# EAGLE design S2ER11 (EAGLE 7.2.0)
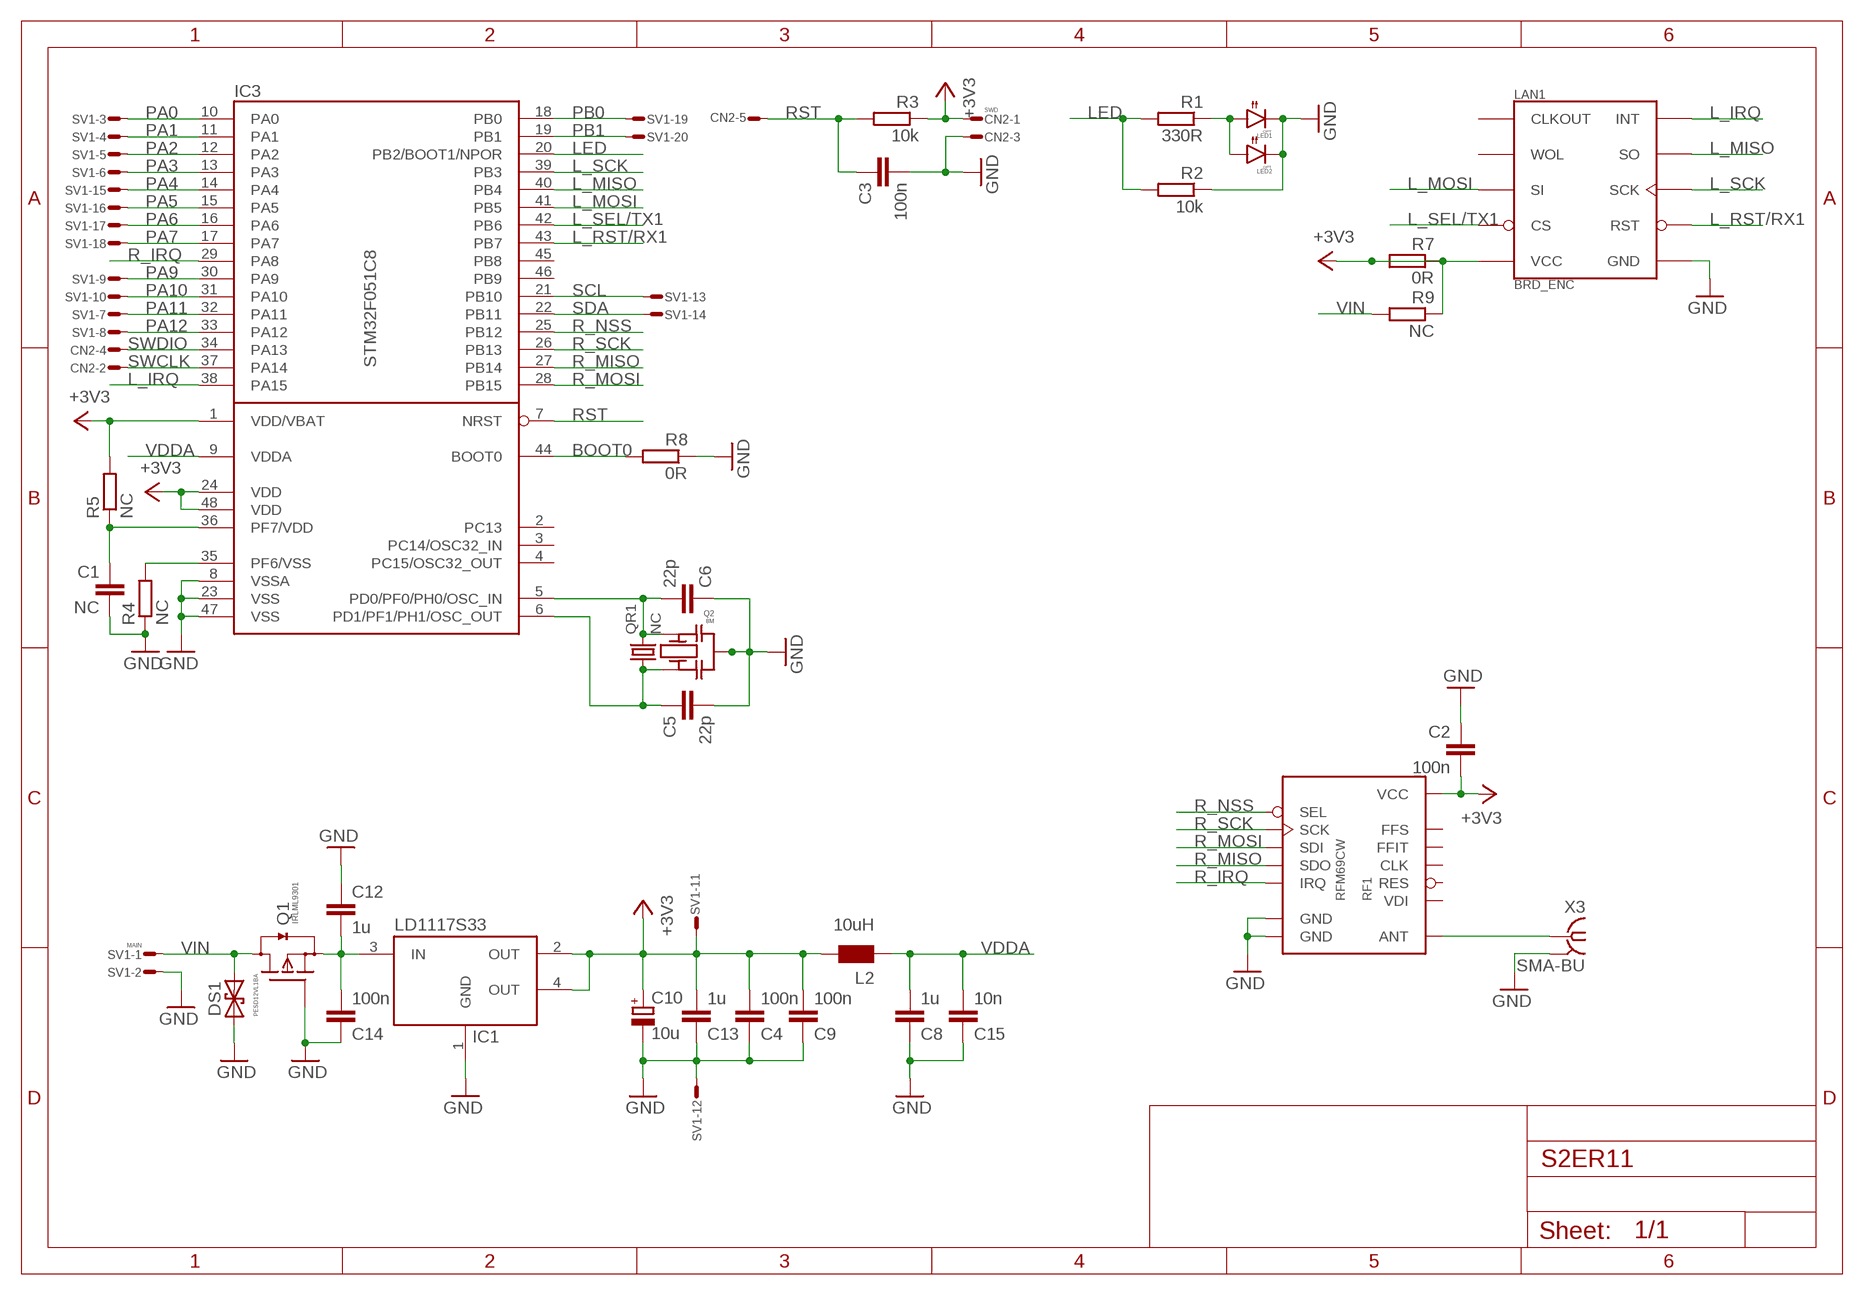
[diagram p0: schematic, sheet 1]

## Parts
C1  NC  C0603  [0603]
C2  100n  C0603  [0603]
C3  100n  C0603  [0603]
C4  100n  C0603  [0603]
C5  22p  C0603  [0603]
C6  22p  C0603  [0603]
C8  1u  C0603  [0603]
C9  100n  C0603  [0603]
C10  10u  C_POLSMCA  [SMC_A]
C12  1u  C0603  [0603]
C13  1u  C0603  [0603]
C14  100n  C0603  [0603]
C15  10n  C0603  [0603]
CN2  SWD  CON6L  [CON6L]
DS1  PESD12VL1BA  TVS-U323  [SOD323]
IC1  LD1117S33  LDO_4P  [SOT223]
IC3  STM32F051C8  STM32_LQFP48  [LQFP48]
L2  10uH  L0603  [0603]
LAN1  BRD_ENC  [BRD_ENC]
LED1  OPT  LEDT134  [T1-3/4]
LED2  OPT  LED1206  [1206]
Q1  IRLML9301  FET-PDSOT23  [SOT23]
Q2  8M  QRCE  [CSTCE]
QR1  NC  QABS07  [ABS07]
R1  330R  R0603  [0603]
R2  10k  R0603  [0603]
R3  10k  R0603  [0603]
R4  NC  R0402  [0402]
R5  NC  R0402  [0402]
R7  0R  R0603  [0603]
R8  0R  R0402  [0402]
R9  NC  R0603  [0603]
RF1  RFM69CW  RFM12B-868-S1  [RFM12B]
SV1  MAIN  ML20LSE  [ML20LS]
X3  SMA-BU  [BU-SMA-V]

## Nets
+3V3: C2.2 C4.2 C9.2 C10.+ C13.2 CN2.1 IC1.2(OUT) IC1.4(OUT) IC3.1(VDD/VBAT) IC3.24(VDD) IC3.48(VDD) L2.2 LAN1.P$9(VCC) R3.1 R5.2 R7.1 R7.2 R9.1 RF1.VDD(VCC) SV1.P$11
BOOT0: IC3.44(BOOT0) R8.2
GND: C1.2 C2.1 C3.2 C4.1 C5.2 C6.1 C8.1 C9.1 C10.- C12.1 C13.1 C14.1 C15.1 CN2.3 DS1.A IC1.1(GND) IC3.8(VSSA) IC3.23(VSS) IC3.47(VSS) LAN1.P$10(GND) LED1.C LED2.2(C) Q1.1(G) Q2.G(M) R2.1 R4.1 R8.1 RF1.GND RF1.GND@1(GND) SV1.P$2 SV1.P$12 X3.2 X3.3 X3.4 X3.5
L_IRQ: IC3.38(PA15) LAN1.P$2(INT)
L_MISO: IC3.40(PB4) LAN1.P$4(SO)
L_MOSI: IC3.41(PB5) LAN1.P$5(SI)
L_RST/RX1: IC3.43(PB7) LAN1.P$8(RST)
L_SCK: IC3.39(PB3) LAN1.P$6(SCK)
L_SEL/TX1: IC3.42(PB6) LAN1.P$7(CS)
LED: IC3.20(PB2/BOOT1/NPOR) R1.2 R2.2
N$1: LED1.A LED2.1(A) R1.1
N$2: IC3.35(PF6/VSS) R4.2
N$3: C1.1 IC3.36(PF7/VDD) R5.1
N$5: RF1.ANT X3.1
N$20: C6.2 IC3.5(PD0/PF0/PH0/OSC_IN) Q2.A QR1.P$2
N$21: C5.1 IC3.6(PD1/PF1/PH1/OSC_OUT) Q2.B QR1.P$1
N$31: C12.2 C14.2 IC1.3(IN) Q1.2(S)
PA0: IC3.10(PA0) SV1.P$3
PA1: IC3.11(PA1) SV1.P$4
PA2: IC3.12(PA2) SV1.P$5
PA3: IC3.13(PA3) SV1.P$6
PA4: IC3.14(PA4) SV1.P$15
PA5: IC3.15(PA5) SV1.P$16
PA6: IC3.16(PA6) SV1.P$17
PA7: IC3.17(PA7) SV1.P$18
PA9: IC3.30(PA9) SV1.P$9
PA10: IC3.31(PA10) SV1.P$10
PA11: IC3.32(PA11) SV1.P$7
PA12: IC3.33(PA12) SV1.P$8
PB0: IC3.18(PB0) SV1.P$19
PB1: IC3.19(PB1) SV1.P$20
R_IRQ: IC3.29(PA8) RF1.IRQ
R_MISO: IC3.27(PB14) RF1.SDO
R_MOSI: IC3.28(PB15) RF1.SDI
R_NSS: IC3.25(PB12) RF1.SEL
R_SCK: IC3.26(PB13) RF1.SCK
RST: C3.1 CN2.5 IC3.7(NRST) R3.2
SCL: IC3.21(PB10) SV1.P$13
SDA: IC3.22(PB11) SV1.P$14
SWCLK: CN2.2 IC3.37(PA14)
SWDIO: CN2.4 IC3.34(PA13)
VDDA: C8.2 C15.2 IC3.9(VDDA) L2.1
VIN: DS1.C Q1.3(D) R9.2 SV1.P$1
Unconnected: CN2.6 IC3.2(PC13) IC3.3(PC14/OSC32_IN) IC3.4(PC15/OSC32_OUT) IC3.45(PB8) IC3.46(PB9) LAN1.P$1(CLKOUT) LAN1.P$3(WOL) RF1./RES(RES) RF1.CFIL(FFIT) RF1.CLK RF1.FFS RF1.INT(VDI)

## Library data of the parts
C1-C6 C8 C9 C12-C15 = RCL:C: Capacitor SMD
C10 = RCL:C_POL: POLARIZED CAPACITOR, European symbol
CN2 = Conn:CON6
DS1 = Diode:TVS-U: DIODE
IC1 = DCDC:LDO_4P
IC3 = STM32:STM32_LQFP48
L2 = RCL:L
LAN1 = brd_enc:BRD_ENC
LED1 LED2 = Optic:LED
Q1 = Transistor:FET-PD
Q2 = QUARTZ:QR
QR1 = QUARTZ:Q
R1-R5 R7-R9 = RCL:R: Resistor SMD
RF1 = RF:RFM12B: 5dB Transceiver Module
SV1 = Conn:ML20?E: HARTING
X3 = Conn:SMA-: SMA 50 Ohm End Launch Jack Receptacle - Round Contact Johnson Components Source: www.johnsoncomponents.com .. J502-ND.pdf

## Board
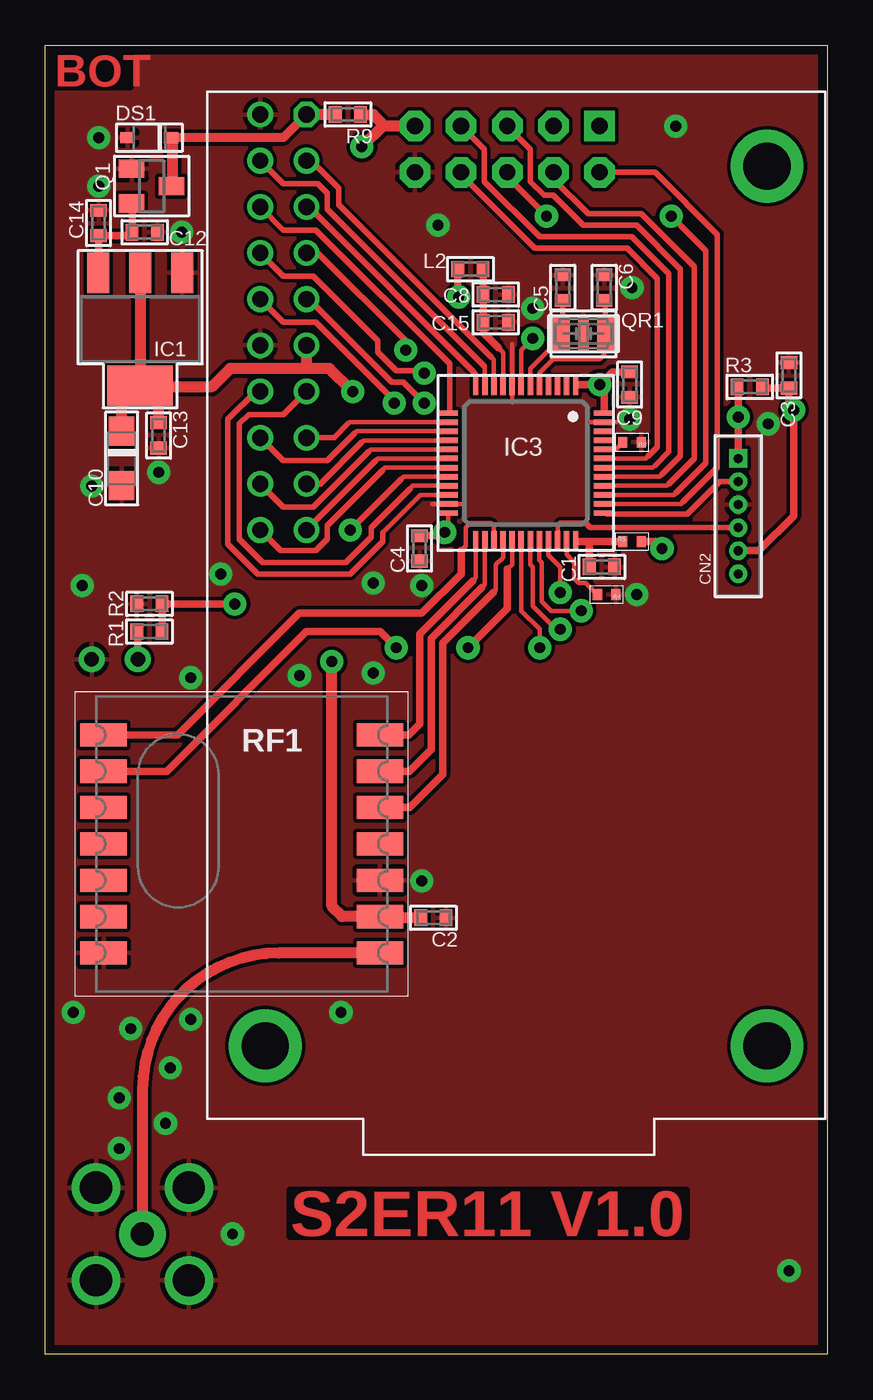
[diagram p1: board, top side]
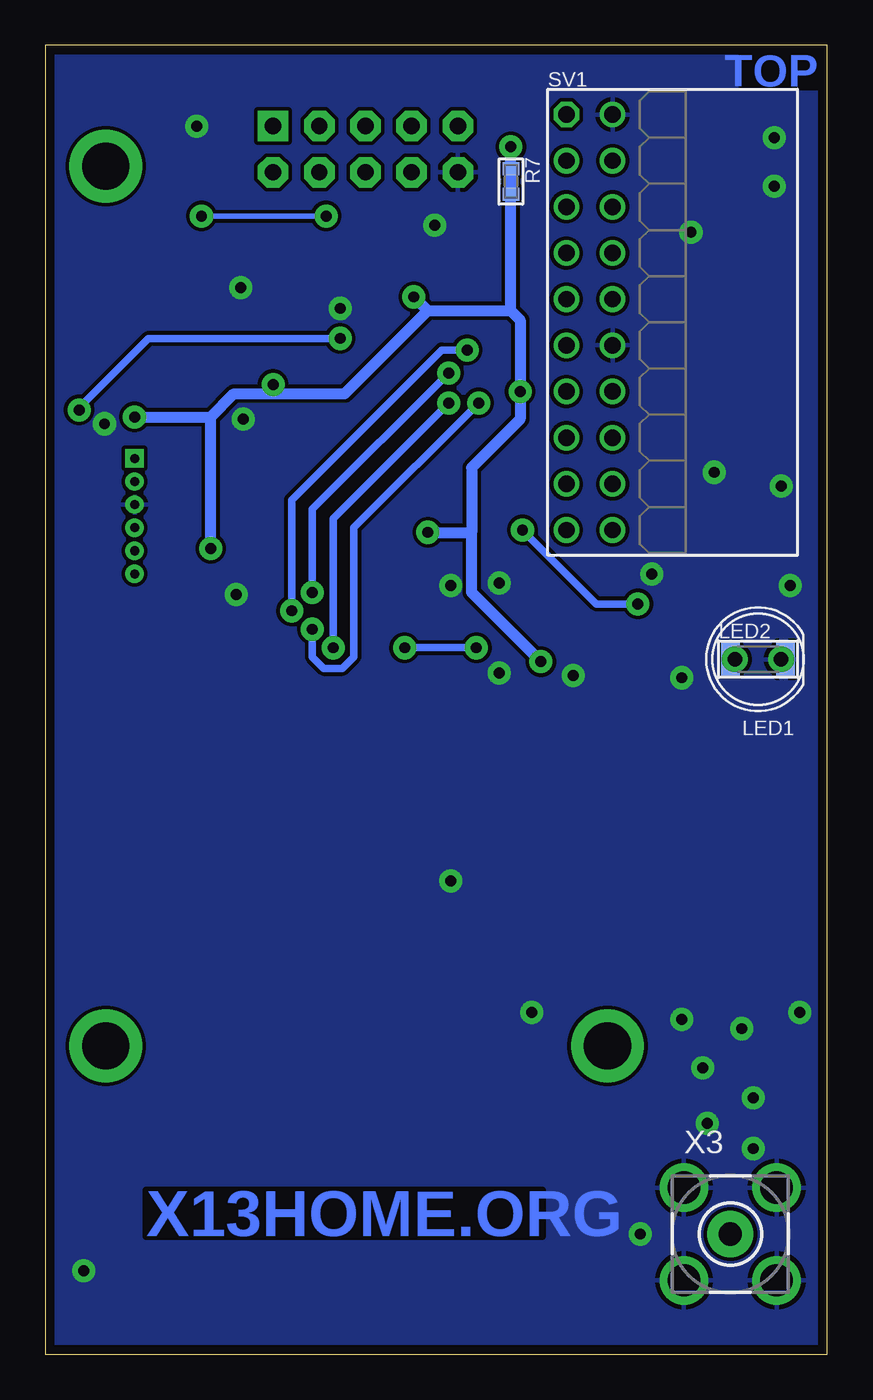
[diagram p2: board, bottom side, seen from below]

Size 43 x 72 mm. Coordinates in mm from the lower left corner, seen from the top.
Outline: 43,0 0,0 0,72 43,72 43,0
Copper layers (1*16): Top 0.035mm / dielectric 1.5mm / Bottom 0.035mm
Design rules "default *": minimum track width 8mil, minimum drill 10mil, track to track 8mil, track to pad 8mil, pad to pad 6mil, via to via 8mil, smd to smd 6mil, copper to edge 20mil, drill to drill 8mil, minimum pad ring 10mil, minimum via ring 8mil, stop-mask expansion 2mil, vias tented up to drill 25mil, thermal gap 10mil
tKeepout: area 0,0 to 43,2.5; area 0,69.5 to 43,72
bKeepout: area 0,0 to 43,1.3; area 0,70.7 to 43,72

### Footprints (pad centres in the part's own frame; a part is rotated, then mirrored left to right if it is on the bottom)
0603 = smd 0.7 x 0.9: 1 -0.697,0; 2 0.697,0
SMC_A = smd 1.6 x 1.4: + -1.5,0; - 1.5,0
CON6L = drill 0.5 pad 0.813 square: 1 0,3.81 | drill 0.5 pad 0.813: 2 0,2.54; 3 0,1.27; 4 0,0; 5 0,-1.27; 6 0,-2.54
SOD323 = smd 0.8 x 0.6: A 1.2,0; C -1.2,0
SOT223 = smd 1.219 x 2.235: 1 -2.311,-3.099; 2 0,-3.099; 3 2.311,-3.099 | smd 3.6 x 2.2: 4 0,3.099
LQFP48 = smd 0.3 x 1: 1 -2.75,-4.25; 2 -2.25,-4.25; 3 -1.75,-4.25; 4 -1.25,-4.25; 5 -0.75,-4.25; 6 -0.25,-4.25; 7 0.25,-4.25; 8 0.75,-4.25; 9 1.25,-4.25; 10 1.75,-4.25; 11 2.25,-4.25; 12 2.75,-4.25; 25 2.75,4.25; 26 2.25,4.25; 27 1.75,4.25; 28 1.25,4.25; 29 0.75,4.25; 30 0.25,4.25; 31 -0.25,4.25; 32 -0.75,4.25; 33 -1.25,4.25; 34 -1.75,4.25; 35 -2.25,4.25; 36 -2.75,4.25 | smd 1 x 0.3: 13 4.25,-2.75; 14 4.25,-2.25; 15 4.25,-1.75; 16 4.25,-1.25; 17 4.25,-0.75; 18 4.25,-0.25; 19 4.25,0.25; 20 4.25,0.75; 21 4.25,1.25; 22 4.25,1.75; 23 4.25,2.25; 24 4.25,2.75; 37 -4.25,2.75; 38 -4.25,2.25; 39 -4.25,1.75; 40 -4.25,1.25; 41 -4.25,0.75; 42 -4.25,0.25; 43 -4.25,-0.25; 44 -4.25,-0.75; 45 -4.25,-1.25; 46 -4.25,-1.75; 47 -4.25,-2.25; 48 -4.25,-2.75
BRD_ENC = drill 0.9 pad 1.676 square: P$1 21.59,54.61 | drill 0.9 pad 1.676 octagon: P$2 21.59,52.07; P$3 19.05,54.61; P$4 19.05,52.07; P$5 16.51,54.61; P$6 16.51,52.07; P$7 13.97,54.61; P$8 13.97,52.07; P$9 11.43,54.61; P$10 11.43,52.07 | drill 2.6 pad 4: PAD@1 3.2,4; PAD@2 30.8,4; PAD@3 30.8,52.4
T1-3/4 = drill 0.8 pad 1.422: A 1.27,0; C -1.27,0
1206 = smd 1.016 x 1.778: 1 -1.524,0; 2 1.524,0
SOT23 = smd 1 x 1.4: 1 -0.95,-1.1; 2 0.95,-1.1; 3 0,1.1
CSTCE = smd 0.6 x 2: A -1.2,0; B 1.2,0; G 0,0
ABS07 = smd 1 x 1.8: P$1 -1.25,0; P$2 1.25,0
0402 = smd 0.5 x 0.6: 1 -0.5,0; 2 0.5,0
RFM12B = smd 2.54 x 1.27: /RES -7.6,-4; ANT 7.6,-6; CFIL -7.6,0; CLK -7.6,-2; FFS -7.6,2; GND 7.6,-2; GND@1 -7.6,-6; INT 7.6,0; IRQ -7.6,4; SCK 7.6,4; SDI 7.6,2; SDO -7.6,6; SEL 7.6,6; VDD 7.6,-4
ML20LS = drill 0.9 octagon: P$1 -11.43,-1.27 | drill 0.9: P$2 -11.43,1.27; P$3 -8.89,-1.27; P$4 -8.89,1.27; P$5 -6.35,-1.27; P$6 -6.35,1.27; P$7 -3.81,-1.27; P$8 -3.81,1.27; P$9 -1.27,-1.27; P$10 -1.27,1.27; P$11 1.27,-1.27; P$12 1.27,1.27; P$13 3.81,-1.27; P$14 3.81,1.27; P$15 6.35,-1.27; P$16 6.35,1.27; P$17 8.89,-1.27; P$18 8.89,1.27; P$19 11.43,-1.27; P$20 11.43,1.27
BU-SMA-V = drill 1.27 pad 2.54: 1 0,0 | drill 1.778: 2 -2.55,2.55; 3 2.55,2.55; 4 2.55,-2.55; 5 -2.55,-2.55

### Placement (x,y rotation side)
C1  30.61,43.31 0 top
C2  21.34,24 180 top
C3  40.89,53.85 90 top
C4  20.57,44.32 90 top
C5  28.45,58.67 90 top
C6  30.73,58.67 270 top
C8  24.77,58.29 180 top
C9  32.13,53.34 90 top
C10  4.19,49.28 270 top
C12  5.46,61.72 180 top
C13  6.22,50.55 90 top
C14  2.92,62.23 270 top
C15  24.77,56.77 180 top
CN2  38.1,45.47 0 top
DS1  5.71,66.93 180 top
IC1  5.21,56.39 180 top
IC3  26.42,49.02 180 top
L2  23.37,59.69 180 top
LAN1  8.89,12.95 0 top
LED1  3.81,38.23 180 bottom
LED2  3.81,38.23 0 bottom
Q1  5.84,64.26 270 top
Q2  29.59,56.13 180 top
QR1  29.59,56.13 0 top
R1  5.71,39.75 0 top
R2  5.71,41.27 0 top
R3  38.73,53.21 0 top
R4  30.86,41.78 180 top
R5  32.26,44.7 0 top
R7  17.4,64.52 270 bottom
R8  32.26,50.16 180 top
R9  16.64,68.2 180 top
RF1  10.79,28.07 0 top
SV1  13.08,56.77 270 bottom
X3  5.33,6.6 0 bottom

### Tracks (layer width: path | path; a pad name or v marks a point on that pad's centre or on a via)
+3V3  (via drill 0.6 pad 1.27)
  Top 0.203: IC3.48 30.67,51.88 30.73,51.94
  Top 0.254: IC3.1 29.27,53.27 29.34,53.34 | IC3.24 22.17,45.41 v21.97,45.21
  Top 0.305: 30.67,53.15 v30.48,53.34
  Top 0.406: CN2.1 v38.1,51.56 38.1,53.15 R3.1 | C9.2 31.18,54.04 v30.48,53.34 | R5.2 33.53,44.7 v33.91,44.32 | 29.34,53.34 v30.48,53.34 | C4.2 21.78,45.02 v21.97,45.21 | v22.73,58.17 22.67,58.23 L2.2 | 30.73,51.94 30.73,53.09 v30.48,53.34
  Top 0.61: SV1.P$11 14.35,54.23 | 14.35,54.23 10.16,54.23 9.14,53.21 6.1,53.21 | 6.1,53.21 5.28,53.21 IC1.4 | v16.89,52.96 15.62,54.23 14.35,54.23 | LAN1.P$9 18.67,67.56 | 18.67,67.56 18.54,67.56 v17.4,66.42 | IC1.2 IC1.4 | C13.2 6.22,53.09 6.1,53.21 | C10.+ 4.19,53.21 5.13,53.21 IC1.4 | R9.1 18.03,68.2 18.67,67.56 | v15.75,38.1 15.75,24.64 16.32,24.07 RF1.VDD 18.46,24 C2.2
  Bottom 0.406: 33.85,47.31 33.91,47.37
  Bottom 0.61: v33.91,44.32 33.91,47.37 33.91,51.56 | 33.91,51.56 32.64,52.83 30.48,52.83 | v38.1,51.56 33.91,51.56 | 19.56,45.21 19.56,48.77 16.89,51.44 v16.89,52.96 16.89,56.9 17.4,57.4 | 30.48,52.83 26.54,52.83 21.97,57.4 | v30.48,53.34 30.48,52.83 | v21.97,45.21 19.56,45.21 | 21.97,57.4 17.4,57.4 | v22.73,58.17 21.97,57.4 | 17.4,57.4 R7.2 R7.1 v17.4,66.42 | v15.75,38.1 19.56,41.91 19.56,45.21
BOOT0
  Top 0.254: IC3.44 31.36,49.77 R8.2
GND  (via drill 0.6 pad 1.27)
  Top 0.254: 25.67,52.34 IC3.8 25.67,55.56 | IC3.47 31.41,51.27 | 29.9,51.27 30.64,51.27 | 22.95,46.77 IC3.23 21.28,46.77
  other vias: 2.92,66.93 32.13,51.44 26.8,57.53 32.26,58.67 39.75,51.18 7.49,61.72 6.22,48.51 20.7,42.29 32.51,41.78 34.67,67.56 21.59,62.1 9.65,42.93 2.54,47.75 2.92,64.26 18.03,42.42 1.52,18.8 8,18.41 16.26,18.8 6.86,15.75 6.6,12.7 4.7,17.91 4.06,14.1 4.06,11.3 10.29,6.6 40.89,4.57 20.7,26.04 18.03,37.47 13.97,37.34 8,37.21 2.03,42.29
  pour Bottom: 43,0 0,0 0,72 43,72
  pour Top: 43,0 0,0 0,72 43,72
L_IRQ
  Top 0.254: IC3.38 34.96,46.77 35.05,46.86
  Top 0.305: LAN1.P$2 33.53,65.02 36.96,61.59 36.96,48.77 35.05,46.86
L_MISO
  Top 0.254: IC3.40 34.18,47.77 34.29,47.88
  Top 0.305: LAN1.P$4 27.94,64.64 29.84,62.74 32.77,62.74 35.69,59.82 35.69,49.28 34.29,47.88
L_MOSI
  Top 0.254: IC3.41 33.79,48.27 33.91,48.39
  Top 0.305: LAN1.P$5 26.67,66.29 26.67,64.52 27.43,63.75 27.94,63.75 29.59,62.1 32.51,62.1 34.92,59.69 34.92,49.4 33.91,48.39
L_RST/RX1
  Top 0.254: IC3.43 33.02,49.27 33.15,49.4
  Top 0.305: LAN1.P$8 22.86,64.9 26.92,60.83 32,60.83 33.66,59.18 33.66,49.91 33.15,49.4
L_SCK  (via drill 0.6 pad 1.27)
  Top 0.254: IC3.39 34.57,47.27 34.67,47.37
  Top 0.305: v34.42,62.61 36.32,60.71 36.32,49.02 34.67,47.37 | LAN1.P$6 25.4,64.77 v27.56,62.61
  Bottom 0.305: v34.42,62.61 v27.56,62.61
L_SEL/TX1
  Top 0.254: IC3.42 33.41,48.77 33.53,48.9
  Top 0.305: LAN1.P$7 24.13,66.29 24.13,64.52 27.18,61.47 32.26,61.47 34.29,59.44 34.29,49.66 33.53,48.9
LED  (via drill 0.6 pad 1.27)
  Top 0.254: IC3.20 19.7,48.27 19.56,48.13
  Top 0.305: 19.56,48.13 v16.76,45.34
  Top 0.406: R1.2 R2.2 v10.41,41.27
  Bottom 0.406: v10.41,41.27 12.7,41.27 v16.76,45.34
N$1
  Top 0.406: LED1.A 5.08,39.69 R1.1
  Bottom 0.406: LED2.1 LED1.A
N$2
  Top 0.254: IC3.35 28.67,43.98 29.08,43.56 29.08,42.67 29.34,42.42 29.73,42.42 R4.2
N$3
  Top 0.254: IC3.36 29.23,44.7 29.34,44.7
  Top 0.406: R5.1 29.91,44.7 | 29.91,44.7 C1.1 | 29.34,44.7 29.91,44.7
N$5
  Top 0.61: RF1.ANT 12.83,22.07 arc90 5.33,14.57 X3.1
N$20
  Top 0.254: IC3.5 27.17,53.96 27.94,54.74 30.48,54.74 30.73,54.99 30.73,56.08 Q2.A | 30.73,56.03 QR1.P$2
  Top 0.305: Q2.A 30.79,58.05 C6.2
  Top 0.61: Q2.A QR1.P$2
N$21
  Top 0.254: IC3.6 26.67,54.23 28.32,55.88 28.32,56.11
  Top 0.305: C5.1 28.45,56.24 QR1.P$1 28.32,56.11 28.32,56.01
  Top 0.61: Q2.B QR1.P$1
N$31
  Top 0.406: Q1.2 4.76,63.29 C12.2 4.57,61.53 C14.2 2.92,59.51 IC1.3
PA0
  Top 0.254: IC3.10 24.67,54.71 24.51,54.86
  Top 0.305: 24.51,54.86 16.13,63.25 16.13,64.14 14.61,65.66 SV1.P$3
PA1
  Top 0.254: IC3.11 24.17,54.32 24.13,54.36
  Top 0.305: 24.13,54.36 15.49,62.99 15.49,63.88 14.99,64.39 13.08,64.39 SV1.P$4
PA2
  Top 0.254: IC3.12 23.67,53.93 23.56,54.04
  Top 0.305: 23.56,54.04 14.48,63.12 SV1.P$5
PA3
  Top 0.203: IC3.13 22.23,51.77 22.23,51.94
  Top 0.305: SV1.P$6 13.08,61.85 14.86,61.85 22.23,54.48 22.23,51.94
PA4
  Top 0.254: IC3.14 16.73,51.27 16.64,51.18
  Top 0.305: SV1.P$15 15.88,50.42 16.64,51.18
PA5
  Top 0.254: IC3.15 17.12,50.77 17.02,50.67
  Top 0.305: 17.02,50.67 15.49,49.15 13.08,49.15 SV1.P$16
PA6
  Top 0.254: IC3.16 17.51,50.27 17.4,50.16
  Top 0.305: 17.4,50.16 15.11,47.88 SV1.P$17
PA7
  Top 0.254: IC3.17 17.89,49.77 17.78,49.66
  Top 0.305: SV1.P$18 13.08,46.61 14.73,46.61 17.78,49.66
PA9  (via drill 0.6 pad 1.27)
  Top 0.254: IC3.30 26.17,40.89 27.18,39.88 v27.18,38.86
  Top 0.305: SV1.P$9 14.48,58.04 19.05,53.47 19.68,53.47 v20.83,52.32
  Bottom 0.406: v20.83,52.32 27.18,45.97 v27.18,38.86
PA10  (via drill 0.6 pad 1.27)
  Top 0.254: 27.94,39.88 28.07,39.88 | IC3.31 26.67,43.44 26.8,43.31 26.8,41.15 28.07,39.88 | 28.07,39.88 v28.32,39.88
  Top 0.305: SV1.P$10 13.08,56.77 14.86,56.77 19.18,52.45 v19.18,52.32
  Bottom 0.406: v28.32,39.88 28.32,38.35 27.69,37.72 26.67,37.72 26.04,38.35 26.04,45.47 v19.18,52.32
PA11  (via drill 0.6 pad 1.27)
  Top 0.254: IC3.32 27.17,43.7 27.3,43.56 27.3,41.4 27.81,40.89 v29.46,40.89
  Top 0.305: v19.81,55.24 19.81,55.75 14.99,60.58 SV1.P$7
  Bottom 0.406: v29.46,40.89 29.46,46.99 21.21,55.24 v19.81,55.24
PA12  (via drill 0.6 pad 1.27)
  Top 0.254: IC3.33 27.67,43.96 28.32,43.31 v28.32,41.91
  Top 0.305: SV1.P$8 13.08,59.31 14.73,59.31 18.29,55.75 18.29,55.12 19.3,54.1 20.7,54.1 v20.83,53.98
  Bottom 0.406: v20.83,53.98 28.32,46.48 v28.32,41.91
PB0
  Top 0.254: IC3.18 18.28,49.27 18.16,49.15
  Top 0.305: 18.16,49.15 SV1.P$19
PB1
  Top 0.254: IC3.19 18.67,48.77 18.54,48.64
  Top 0.305: 18.54,48.64 15.49,45.59 15.49,44.83 14.86,44.2 12.95,44.2 SV1.P$20
R_IRQ  (via drill 0.6 pad 1.27)
  Top 0.254: IC3.29 25.67,43.45 25.4,43.18
  Top 0.406: 25.4,43.18 25.4,41.02 v23.24,38.86 | v19.3,38.86 18.41,39.75 14.35,39.75 6.67,32.07 RF1.IRQ
  Bottom 0.406: v23.24,38.86 v19.3,38.86
R_MISO
  Top 0.254: IC3.27 24.67,45.56 24.51,45.72 23.37,45.72 23.11,45.47 23.11,44.45 22.86,44.2
  Top 0.406: 22.86,44.2 22.86,42.93 20.7,40.77 13.97,40.77 7.27,34.07 RF1.SDO
R_MOSI
  Top 0.254: IC3.28 25.17,43.84 24.77,43.43 24.77,42.04 24.64,41.91
  Top 0.406: 24.64,41.91 21.84,39.12 21.84,31.88 20.03,30.07 RF1.SDI
R_NSS
  Top 0.254: IC3.25 23.67,42.72 23.5,42.55
  Top 0.406: 23.5,42.55 20.57,39.62 20.57,34.67 19.97,34.07 RF1.SEL
R_SCK
  Top 0.254: IC3.26 24.17,42.33 24,42.16
  Top 0.406: 24,42.16 21.21,39.37 21.21,33.27 20,32.07 RF1.SCK
RST  (via drill 0.6 pad 1.27)
  Top 0.254: IC3.7 26.17,55.25 v26.8,55.88
  Top 0.406: CN2.5 39.24,44.2 41.15,46.1 v41.15,51.94 40.89,52.2 C3.1 39.49,53.15 R3.2
  Bottom 0.406: v26.8,55.88 37.34,55.88 41.15,52.07 v41.15,51.94
SCL
  Top 0.254: IC3.21 20.21,47.77 20.07,47.62
  Top 0.305: 20.07,47.62 17.91,45.47 17.91,44.96 16.51,43.56 11.94,43.56 10.67,44.83 10.67,51.18 11.18,51.69 13.08,51.69 SV1.P$13
SDA
  Top 0.254: IC3.22 20.6,47.27 18.54,45.21
  Top 0.305: 18.54,45.21 18.54,44.7 16.76,42.93 11.68,42.93 10.03,44.58 10.03,51.44 11.56,52.96 SV1.P$14
SWCLK
  Top 0.254: IC3.37 30.82,46.27 30.86,46.23
  Top 0.305: 30.86,46.23 35.31,46.23 37.08,48.01 CN2.2
SWDIO
  Top 0.254: IC3.34 28.17,45.56 28.32,45.72
  Top 0.305: 28.32,45.72 29.72,45.72 29.97,45.47 CN2.4
VDDA
  Top 0.254: IC3.9 25.17,55.1 24.89,55.37
  Top 0.406: 24.89,55.37 24.07,56.2 C15.2 C8.2 L2.1
VIN
  Top 0.406: 6.92,64.29 Q1.3 | DS1.C 6.92,66.75 6.99,66.67
  Top 0.508: SV1.P$1 13.08,66.93 DS1.C
  Top 0.61: R9.2 SV1.P$1 | 6.99,66.67 6.99,64.31 Q1.3

### Text on the board
Top: BOT | S2ER11 V1.0
Bottom: TOP | X13HOME.ORG